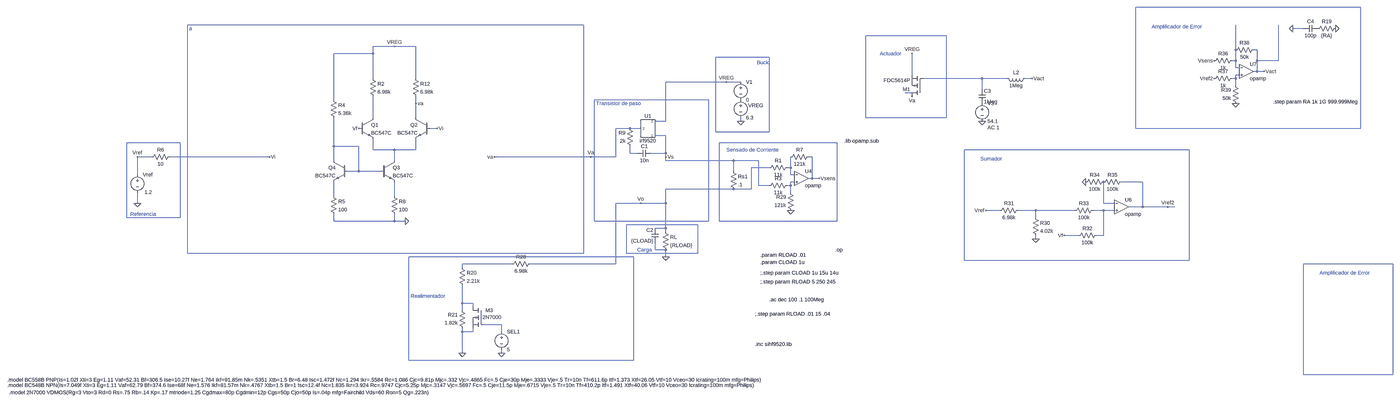
[diagram p0: schematic LDO_sin_compensarI.asc, whole sheet]
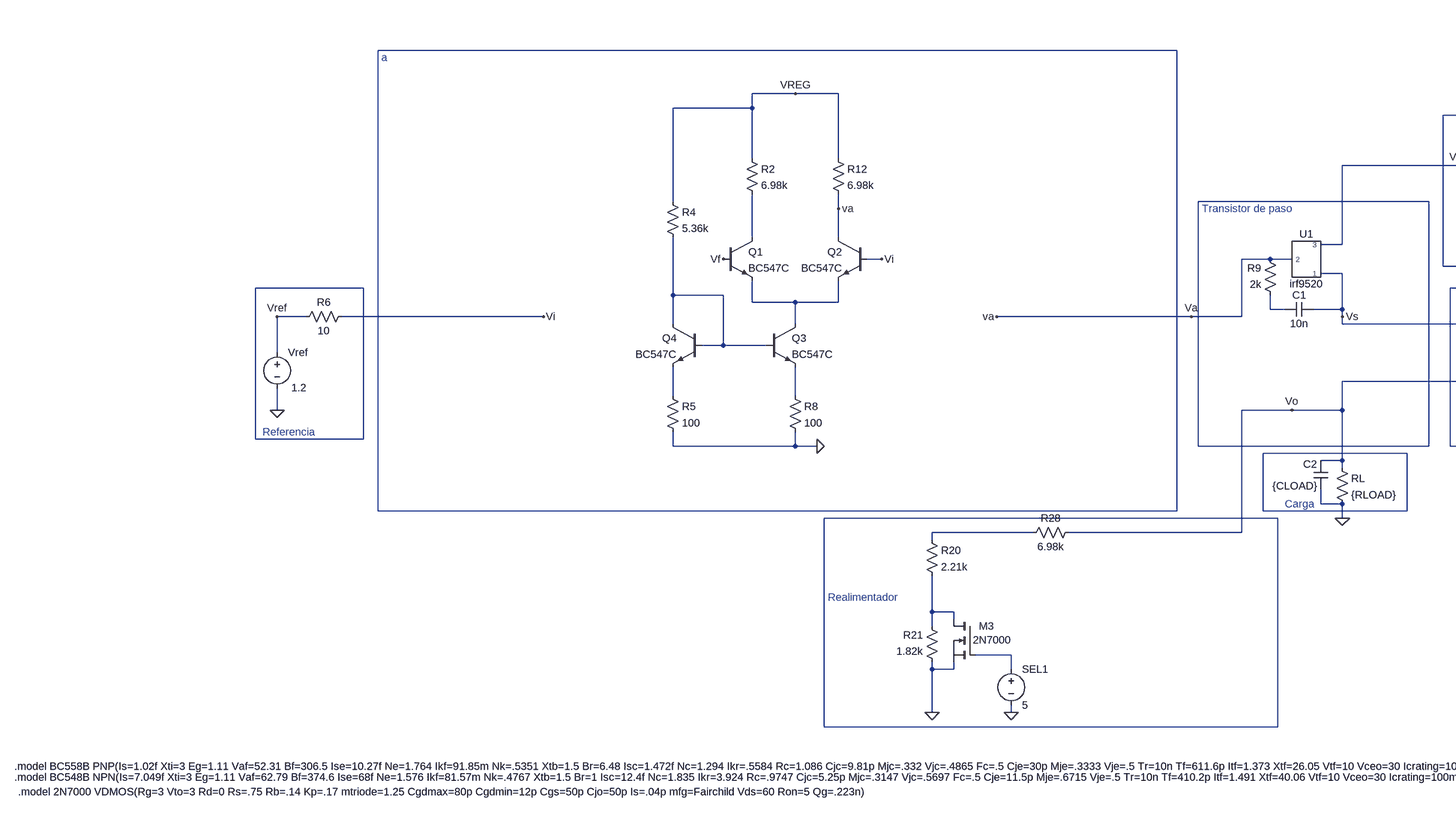
[diagram p1: schematic LDO_sin_compensarI.asc, part, row 1 of 1, column 1 of 2]
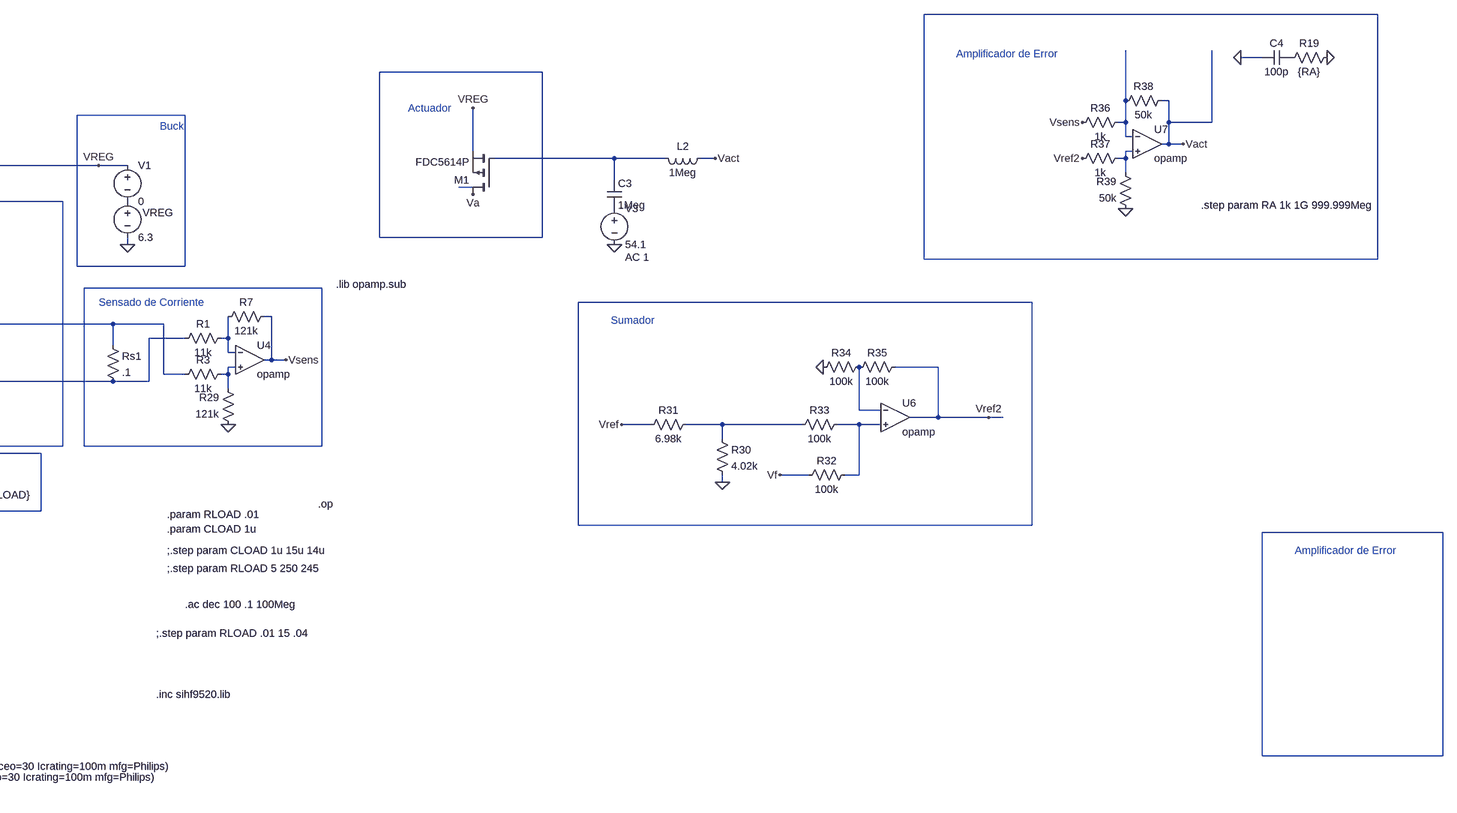
[diagram p2: schematic LDO_sin_compensarI.asc, part, row 1 of 1, column 2 of 2]
LDO_sin_compensarI.asc, the LTspice schematic file:
Version 4
SHEET 1 26844 1652
WIRE 4848 -560 3840 -560
WIRE 1264 -480 -512 -480
WIRE 4592 -464 4544 -464
WIRE 2992 -432 2528 -432
WIRE 416 -384 320 -384
WIRE 512 -384 416 -384
WIRE 4288 -368 4288 -480
WIRE 4384 -368 4368 -368
WIRE 320 -352 320 -384
WIRE 320 -352 144 -352
WIRE 2096 -336 1856 -336
WIRE 4288 -320 4288 -368
WIRE 4288 -320 4272 -320
WIRE 4384 -320 4384 -368
WIRE 4480 -320 4480 -480
WIRE 4480 -320 4384 -320
WIRE 4288 -288 4288 -320
WIRE 4304 -288 4288 -288
WIRE 4384 -272 4384 -320
WIRE 4384 -272 4368 -272
WIRE 4416 -272 4384 -272
WIRE 2736 -256 2736 -352
WIRE 4304 -256 4288 -256
WIRE 320 -240 320 -352
WIRE 512 -240 512 -384
WIRE 3152 -240 2784 -240
WIRE 3264 -240 3152 -240
WIRE 3376 -240 3344 -240
WIRE 4288 -240 4288 -256
WIRE 4288 -240 4272 -240
WIRE 1904 -224 1632 -224
WIRE 1968 -224 1904 -224
WIRE 4288 -208 4288 -240
WIRE 3152 -192 3152 -240
WIRE 2736 -176 2704 -176
WIRE 144 -144 144 -352
WIRE 1824 -144 1312 -144
WIRE 512 -128 512 -160
WIRE 320 -64 320 -160
WIRE 512 -64 512 -128
WIRE 2528 -64 2528 -432
WIRE 2992 -64 2992 -432
WIRE 2992 -64 2528 -64
WIRE 1632 -48 1632 -224
WIRE 1632 -48 1584 -48
WIRE 1968 -48 1968 -64
WIRE 608 -16 576 -16
WIRE 1472 -16 1408 -16
WIRE 1520 -16 1472 -16
WIRE 3840 -16 3840 -560
WIRE 4848 -16 4848 -560
WIRE 4848 -16 3840 -16
WIRE 1856 0 1856 -336
WIRE 2096 0 2096 -336
WIRE 2096 0 1856 0
WIRE 1632 16 1584 16
WIRE -544 48 -784 48
WIRE 2400 48 1872 48
WIRE 144 64 144 -64
WIRE 256 64 144 64
WIRE 320 80 320 32
WIRE 416 80 320 80
WIRE 512 80 512 32
WIRE 512 80 416 80
WIRE 4080 80 3072 80
WIRE 1472 96 1472 64
WIRE 1504 96 1472 96
WIRE 1632 96 1632 16
WIRE 1632 96 1568 96
WIRE -672 112 -736 112
WIRE -144 112 -592 112
WIRE 1296 112 864 112
WIRE 1408 112 1408 -16
WIRE 1408 112 1296 112
WIRE 1632 112 1632 96
WIRE 2288 112 2272 112
WIRE 144 128 144 64
WIRE 416 128 416 80
WIRE 1632 128 1632 112
WIRE 1936 128 1632 128
WIRE 2048 128 1936 128
WIRE 2096 160 2016 160
WIRE 2192 160 2192 112
WIRE 2192 160 2176 160
WIRE 256 176 256 64
WIRE 256 176 208 176
WIRE 352 176 256 176
WIRE 1936 176 1936 128
WIRE -736 192 -736 112
WIRE 2192 192 2192 160
WIRE 2208 192 2192 192
WIRE 2288 208 2288 112
WIRE 2288 208 2272 208
WIRE 2320 208 2288 208
WIRE 2208 224 2192 224
WIRE 3872 224 3776 224
WIRE 2048 240 2048 128
WIRE 2096 240 2048 240
WIRE 2192 240 2192 224
WIRE 2192 240 2176 240
WIRE 1936 256 1632 256
WIRE 2016 256 2016 160
WIRE 2016 256 1936 256
WIRE 2192 272 2192 240
WIRE 144 288 144 224
WIRE 416 288 416 224
WIRE -736 320 -736 272
WIRE 1520 320 1408 320
WIRE 1632 320 1632 256
WIRE 1632 320 1520 320
WIRE 3696 320 3696 224
WIRE 3744 320 3696 320
WIRE 3872 336 3872 224
WIRE 3872 336 3808 336
WIRE 3984 336 3872 336
WIRE 4016 336 3984 336
WIRE 3232 352 3168 352
WIRE 3392 352 3312 352
WIRE 3568 352 3392 352
WIRE 3696 352 3648 352
WIRE 3744 352 3696 352
WIRE -784 384 -784 48
WIRE -544 384 -544 48
WIRE -544 384 -784 384
WIRE 3392 384 3392 352
WIRE 144 400 144 368
WIRE 416 400 416 368
WIRE 416 400 144 400
WIRE 464 400 416 400
WIRE 1312 400 1312 -144
WIRE 1824 400 1824 -144
WIRE 1824 400 1312 400
WIRE 1872 400 1872 48
WIRE 2400 400 2400 48
WIRE 2400 400 1872 400
WIRE 1776 416 1456 416
WIRE 1632 432 1632 320
WIRE 1632 432 1584 432
WIRE 1632 448 1632 432
WIRE 3584 464 3520 464
WIRE 3696 464 3696 352
WIRE 3696 464 3664 464
WIRE 3392 480 3392 464
WIRE 1584 528 1584 496
WIRE 1632 528 1584 528
WIRE -512 544 -512 -480
WIRE 1264 544 1264 -480
WIRE 1264 544 -512 544
WIRE 1456 544 1456 416
WIRE 1776 544 1776 416
WIRE 1776 544 1456 544
WIRE 1488 560 480 560
WIRE 1632 560 1632 528
WIRE 3072 576 3072 80
WIRE 4080 576 4080 80
WIRE 4080 576 3072 576
WIRE 944 592 720 592
WIRE 1408 592 1408 320
WIRE 1408 592 1024 592
WIRE 5600 592 4592 592
WIRE 720 608 720 592
WIRE 720 768 720 688
WIRE 768 768 720 768
WIRE 768 784 768 768
WIRE 720 800 720 768
WIRE 896 864 816 864
WIRE 720 896 720 880
WIRE 768 896 768 880
WIRE 768 896 720 896
WIRE 896 896 896 864
WIRE 720 992 720 896
WIRE 896 992 896 976
WIRE 480 1024 480 560
WIRE 1488 1024 1488 560
WIRE 1488 1024 480 1024
WIRE 4592 1088 4592 592
WIRE 5600 1088 5600 592
WIRE 5600 1088 4592 1088
FLAG 1632 560 0
FLAG -736 320 0
FLAG 1296 112 Va
FLAG -736 112 Vref
FLAG 1520 320 Vo
FLAG 1968 -48 0
FLAG -144 112 Vi
FLAG 864 112 va
FLAG 1904 -224 VREG
FLAG 2736 -352 VREG
FLAG 3376 -240 Vact
FLAG 2736 -160 Va
FLAG 3152 -48 0
FLAG 1632 112 Vs
FLAG 464 400 0
FLAG 416 -384 VREG
FLAG 512 -128 va
FLAG 608 -16 Vi
FLAG 256 -16 Vf
FLAG 720 992 0
FLAG 896 992 0
FLAG 2320 208 Vsens
FLAG 2192 352 0
FLAG 3392 480 0
FLAG 3984 336 Vref2
FLAG 3168 352 Vref
FLAG 3520 464 Vf
FLAG 3616 224 0
FLAG 4288 -128 0
FLAG 4416 -272 Vact
FLAG 4192 -240 Vref2
FLAG 4192 -320 Vsens
FLAG 4736 -464 0
FLAG 4544 -464 0
DATAFLAG 3040 -240 ""
DATAFLAG 2752 272 "I(Rs)"
SYMBOL voltage -736 176 R0
WINDOW 123 0 0 Left 0
WINDOW 39 0 0 Left 0
WINDOW 3 66 94 Right 2
SYMATTR Value 1.2
SYMATTR InstName Vref
SYMBOL res 1616 432 R0
SYMATTR InstName RL
SYMATTR Value {RLOAD}
SYMBOL voltage 1968 -160 R0
WINDOW 123 0 0 Left 0
WINDOW 39 0 0 Left 0
WINDOW 0 34 41 Left 2
SYMATTR InstName VREG
SYMATTR Value 6.3
SYMBOL voltage 1968 -240 R0
WINDOW 123 0 0 Left 0
WINDOW 39 0 0 Left 0
SYMATTR InstName V1
SYMATTR Value 0
SYMBOL res -576 96 R90
WINDOW 0 0 56 VBottom 2
WINDOW 3 32 56 VTop 2
SYMATTR InstName R6
SYMATTR Value 10
SYMBOL AutoGenerated\\irf9520 1552 -16 R0
SYMATTR InstName U1
SYMBOL pmos 2784 -160 R180
SYMATTR InstName M1
SYMATTR Value FDC5614P
SYMBOL cap 1600 496 R180
WINDOW 0 24 56 Left 2
WINDOW 3 24 8 Left 2
SYMATTR InstName C2
SYMATTR Value {CLOAD}
SYMBOL ind 3360 -256 R90
WINDOW 0 5 56 VBottom 2
WINDOW 3 32 56 VTop 2
SYMATTR InstName L2
SYMATTR Value 1Meg
SYMBOL cap 3136 -192 R0
SYMATTR InstName C3
SYMATTR Value 1Meg
SYMBOL voltage 3152 -144 R0
WINDOW 123 24 124 Left 2
WINDOW 39 0 0 Left 0
SYMATTR Value2 AC 1
SYMATTR InstName V3
SYMATTR Value 54.1
SYMBOL cap 1568 80 R90
WINDOW 0 0 32 VBottom 2
WINDOW 3 32 32 VTop 2
SYMATTR InstName C1
SYMATTR Value 10n
SYMBOL res 1488 80 R180
WINDOW 0 36 76 Left 2
WINDOW 3 36 40 Left 2
SYMATTR InstName R9
SYMATTR Value 2k
SYMBOL res 4752 -480 R90
WINDOW 0 0 56 VBottom 2
WINDOW 3 32 56 VTop 2
SYMATTR InstName R19
SYMATTR Value {RA}
SYMBOL cap 4656 -480 R90
WINDOW 0 0 32 VBottom 2
WINDOW 3 32 32 VTop 2
SYMATTR InstName C4
SYMATTR Value 100p
SYMBOL npn 256 -64 R0
SYMATTR InstName Q1
SYMATTR Value BC547C
SYMBOL npn 576 -64 M0
SYMATTR InstName Q2
SYMATTR Value BC547C
SYMBOL res 304 -256 R0
SYMATTR InstName R2
SYMATTR Value 6.98k
SYMBOL npn 352 128 R0
SYMATTR InstName Q3
SYMATTR Value BC547C
SYMBOL npn 208 128 M0
SYMATTR InstName Q4
SYMATTR Value BC547C
SYMBOL res 128 -160 R0
SYMATTR InstName R4
SYMATTR Value 5.36k
SYMBOL res 128 272 R0
SYMATTR InstName R5
SYMATTR Value 100
SYMBOL res 400 272 R0
SYMATTR InstName R8
SYMATTR Value 100
SYMBOL res 496 -256 R0
SYMATTR InstName R12
SYMATTR Value 6.98k
SYMBOL res 704 592 R0
SYMATTR InstName R20
SYMATTR Value 2.21k
SYMBOL res 736 896 R180
WINDOW 0 36 76 Left 2
WINDOW 3 36 40 Left 2
SYMATTR InstName R21
SYMATTR Value 1.82k
SYMBOL res 1040 576 R90
WINDOW 0 0 56 VBottom 2
WINDOW 3 32 56 VTop 2
SYMATTR InstName R28
SYMATTR Value 6.98k
SYMBOL voltage 896 880 R0
WINDOW 123 0 0 Left 0
WINDOW 39 0 0 Left 0
SYMATTR InstName SEL1
SYMATTR Value 5
SYMBOL nmos 816 784 M0
WINDOW 0 -42 16 Left 2
WINDOW 3 -80 47 Left 2
SYMATTR InstName M3
SYMATTR Value 2N7000
SYMBOL res 1920 160 R0
SYMATTR InstName Rs1
SYMATTR Value .1
SYMBOL OpAmps\\opamp 2240 144 R0
SYMATTR InstName U4
SYMBOL res 2192 144 R90
WINDOW 0 0 56 VBottom 2
WINDOW 3 32 56 VTop 2
SYMATTR InstName R1
SYMATTR Value 11k
SYMBOL res 2192 224 R90
WINDOW 0 0 56 VBottom 2
WINDOW 3 32 56 VTop 2
SYMATTR InstName R3
SYMATTR Value 11k
SYMBOL res 2288 96 R90
WINDOW 0 0 56 VBottom 2
WINDOW 3 32 56 VTop 2
SYMATTR InstName R7
SYMATTR Value 121k
SYMBOL res 2208 368 R180
WINDOW 0 36 76 Left 2
WINDOW 3 36 40 Left 2
SYMATTR InstName R29
SYMATTR Value 121k
SYMBOL res 3376 368 R0
SYMATTR InstName R30
SYMATTR Value 4.02k
SYMBOL res 3328 336 R90
WINDOW 0 0 56 VBottom 2
WINDOW 3 32 56 VTop 2
SYMATTR InstName R31
SYMATTR Value 6.98k
SYMBOL res 3680 448 R90
WINDOW 0 0 56 VBottom 2
WINDOW 3 32 56 VTop 2
SYMATTR InstName R32
SYMATTR Value 100k
SYMBOL res 3664 336 R90
WINDOW 0 0 56 VBottom 2
WINDOW 3 32 56 VTop 2
SYMATTR InstName R33
SYMATTR Value 100k
SYMBOL OpAmps\\opamp 3776 272 R0
SYMATTR InstName U6
SYMBOL res 3712 208 R90
WINDOW 0 0 56 VBottom 2
WINDOW 3 32 56 VTop 2
SYMATTR InstName R34
SYMATTR Value 100k
SYMBOL res 3792 208 R90
WINDOW 0 0 56 VBottom 2
WINDOW 3 32 56 VTop 2
SYMATTR InstName R35
SYMATTR Value 100k
SYMBOL OpAmps\\opamp 4336 -336 R0
SYMATTR InstName U7
SYMBOL res 4288 -336 R90
WINDOW 0 0 56 VBottom 2
WINDOW 3 32 56 VTop 2
SYMATTR InstName R36
SYMATTR Value 1k
SYMBOL res 4288 -256 R90
WINDOW 0 0 56 VBottom 2
WINDOW 3 32 56 VTop 2
SYMATTR InstName R37
SYMATTR Value 1k
SYMBOL res 4384 -384 R90
WINDOW 0 0 56 VBottom 2
WINDOW 3 32 56 VTop 2
SYMATTR InstName R38
SYMATTR Value 50k
SYMBOL res 4304 -112 R180
WINDOW 0 36 76 Left 2
WINDOW 3 36 40 Left 2
SYMATTR InstName R39
SYMATTR Value 50k
TEXT -768 368 Left 2 ;Referencia
TEXT 488 736 Left 2 ;Realimentador
TEXT -504 -464 Left 2 ;a
TEXT 1320 -128 Left 2 ;Transistor de paso
TEXT 1504 528 Left 2 ;Carga
TEXT 2032 816 Left 2 !;.step param RLOAD .01 15 .04
TEXT -1320 1112 Left 2 !.model BC558B PNP(Is=1.02f Xti=3 Eg=1.11 Vaf=52.31 Bf=306.5 Ise=10.27f Ne=1.764 Ikf=91.85m Nk=.5351 Xtb=1.5 Br=6.48 Isc=1.472f Nc=1.294 Ikr=.5584 Rc=1.086 Cjc=9.81p Mjc=.332 Vjc=.4865 Fc=.5 Cje=30p Mje=.3333 Vje=.5 Tr=10n Tf=611.6p Itf=1.373 Xtf=26.05 Vtf=10 Vceo=30 Icrating=100m mfg=Philips)
TEXT -1320 1136 Left 2 !.model BC548B NPN(Is=7.049f Xti=3 Eg=1.11 Vaf=62.79 Bf=374.6 Ise=68f Ne=1.576 Ikf=81.57m Nk=.4767 Xtb=1.5 Br=1 Isc=12.4f Nc=1.835 Ikr=3.924 Rc=.9747 Cjc=5.25p Mjc=.3147 Vjc=.5697 Fc=.5 Cje=11.5p Mje=.6715 Vje=.5 Tr=10n Tf=410.2p Itf=1.491 Xtf=40.06 Vtf=10 Vceo=30 Icrating=100m mfg=Philips)
TEXT 2392 528 Left 2 !.op
TEXT 2040 -312 Left 2 ;Buck
TEXT 2032 952 Left 2 !.inc sihf9520.lib
TEXT -1312 1168 Left 2 !.model 2N7000 VDMOS(Rg=3 Vto=3 Rd=0 Rs=.75 Rb=.14 Kp=.17 mtriode=1.25 Cgdmax=80p Cgdmin=12p Cgs=50p Cjo=50p Is=.04p mfg=Fairchild Vds=60 Ron=5 Qg=.223n)
TEXT 2592 -352 Left 2 ;Actuador
TEXT 3912 -472 Left 2 ;Amplificador de Error
TEXT 2096 752 Left 2 !.ac dec 100 .1 100Meg
TEXT 2056 672 Left 2 !;.step param RLOAD 5 250 245
TEXT 2056 632 Left 2 !;.step param CLOAD 1u 15u 14u
TEXT 2056 584 Left 2 !.param CLOAD 1u
TEXT 2056 552 Left 2 !.param RLOAD .01
TEXT 4456 -136 Left 2 !.step param RA 1k 1G 999.999Meg
TEXT 2432 40 Left 2 !.lib opamp.sub
TEXT 3144 120 Left 2 ;Sumador
TEXT 4664 632 Left 2 ;Amplificador de Error
TEXT 1904 80 Left 2 ;Sensado de Corriente

The netlist it stands for:
* LDO_sin_compensarI.asc
Vref Vref 0 1.2
RL Vo 0 {RLOAD}
VREG P001 0 6.3
V1 VREG P001 0
R6 Vi Vref 10
XU1 Vs Va VREG irf9520  ; pins 1 2 3
M1 Va N007 VREG VREG FDC5614P
C2 0 Vo {CLOAD}
L2 Vact N007 1Meg
C3 N007 P002 1Meg
V3 P002 0 54.1 AC 1
C1 Vs N016 10n
R9 N016 Va 2k
R19 0 P003 {RA}
C4 P003 0 100p
Q1 N010 Vf N014 0 BC547C
Q2 Va Vi N014 0 BC547C
R2 VREG N010 6.98k
Q3 N014 N013 N020 0 BC547C
Q4 N013 N013 N019 0 BC547C
R4 VREG N013 5.36k
R5 N019 0 100
R8 N020 0 100
R12 VREG Va 6.98k
R20 N026 N028 2.21k
R21 0 N028 1.82k
R28 Vo N026 6.98k
V§SEL1 N029 0 5
M3 N028 N029 0 0 2N7000
Rs1 Vs Vo .1
XU4 N017 N018 Vsens opamp Aol=100K GBW=10Meg  ; pins invin noninvin out
R1 N017 Vo 11k
R3 N018 Vs 11k
R7 Vsens N017 121k
R29 0 N018 121k
R30 N022 0 4.02k
R31 N022 Vref 6.98k
R32 N023 Vf 100k
R33 N023 N022 100k
XU6 N021 N023 Vref2 opamp Aol=100K GBW=10Meg  ; pins invin noninvin out
R34 N021 0 100k
R35 Vref2 N021 100k
XU7 N004 N006 Vact opamp Aol=100K GBW=10Meg  ; pins invin noninvin out
R36 N004 Vsens 1k
R37 N006 Vref2 1k
R38 Vact N004 50k
R39 0 N006 50k
.model NPN NPN
.model PNP PNP
.lib standard.bjt
.model NMOS NMOS
.model PMOS PMOS
.lib standard.mos
* Referencia
* Realimentador
* a
* Transistor de paso
* Carga
;.step param RLOAD .01 15 .04
.model BC558B PNP(Is=1.02f Xti=3 Eg=1.11 Vaf=52.31 Bf=306.5 Ise=10.27f Ne=1.764 Ikf=91.85m Nk=.5351 Xtb=1.5 Br=6.48 Isc=1.472f Nc=1.294 Ikr=.5584 Rc=1.086 Cjc=9.81p Mjc=.332 Vjc=.4865 Fc=.5 Cje=30p Mje=.3333 Vje=.5 Tr=10n Tf=611.6p Itf=1.373 Xtf=26.05 Vtf=10 Vceo=30 Icrating=100m mfg=Philips)
.model BC548B NPN(Is=7.049f Xti=3 Eg=1.11 Vaf=62.79 Bf=374.6 Ise=68f Ne=1.576 Ikf=81.57m Nk=.4767 Xtb=1.5 Br=1 Isc=12.4f Nc=1.835 Ikr=3.924 Rc=.9747 Cjc=5.25p Mjc=.3147 Vjc=.5697 Fc=.5 Cje=11.5p Mje=.6715 Vje=.5 Tr=10n Tf=410.2p Itf=1.491 Xtf=40.06 Vtf=10 Vceo=30 Icrating=100m mfg=Philips)
.op
* Buck
.inc sihf9520.lib
.model 2N7000 VDMOS(Rg=3 Vto=3 Rd=0 Rs=.75 Rb=.14 Kp=.17 mtriode=1.25 Cgdmax=80p Cgdmin=12p Cgs=50p Cjo=50p Is=.04p mfg=Fairchild Vds=60 Ron=5 Qg=.223n)
* Actuador
* Amplificador de Error
.ac dec 100 .1 100Meg
;.step param RLOAD 5 250 245
;.step param CLOAD 1u 15u 14u
.param CLOAD 1u
.param RLOAD .01
.step param RA 1k 1G 999.999Meg
.lib opamp.sub
* Sumador
* Amplificador de Error
* Sensado de Corriente
.lib sihf9520.txt
.backanno
.end